# EAGLE schematic bigben (EAGLE 6.5.0)
AUTHOR: Brad Campbell; REV: A; TITLE: BigBen
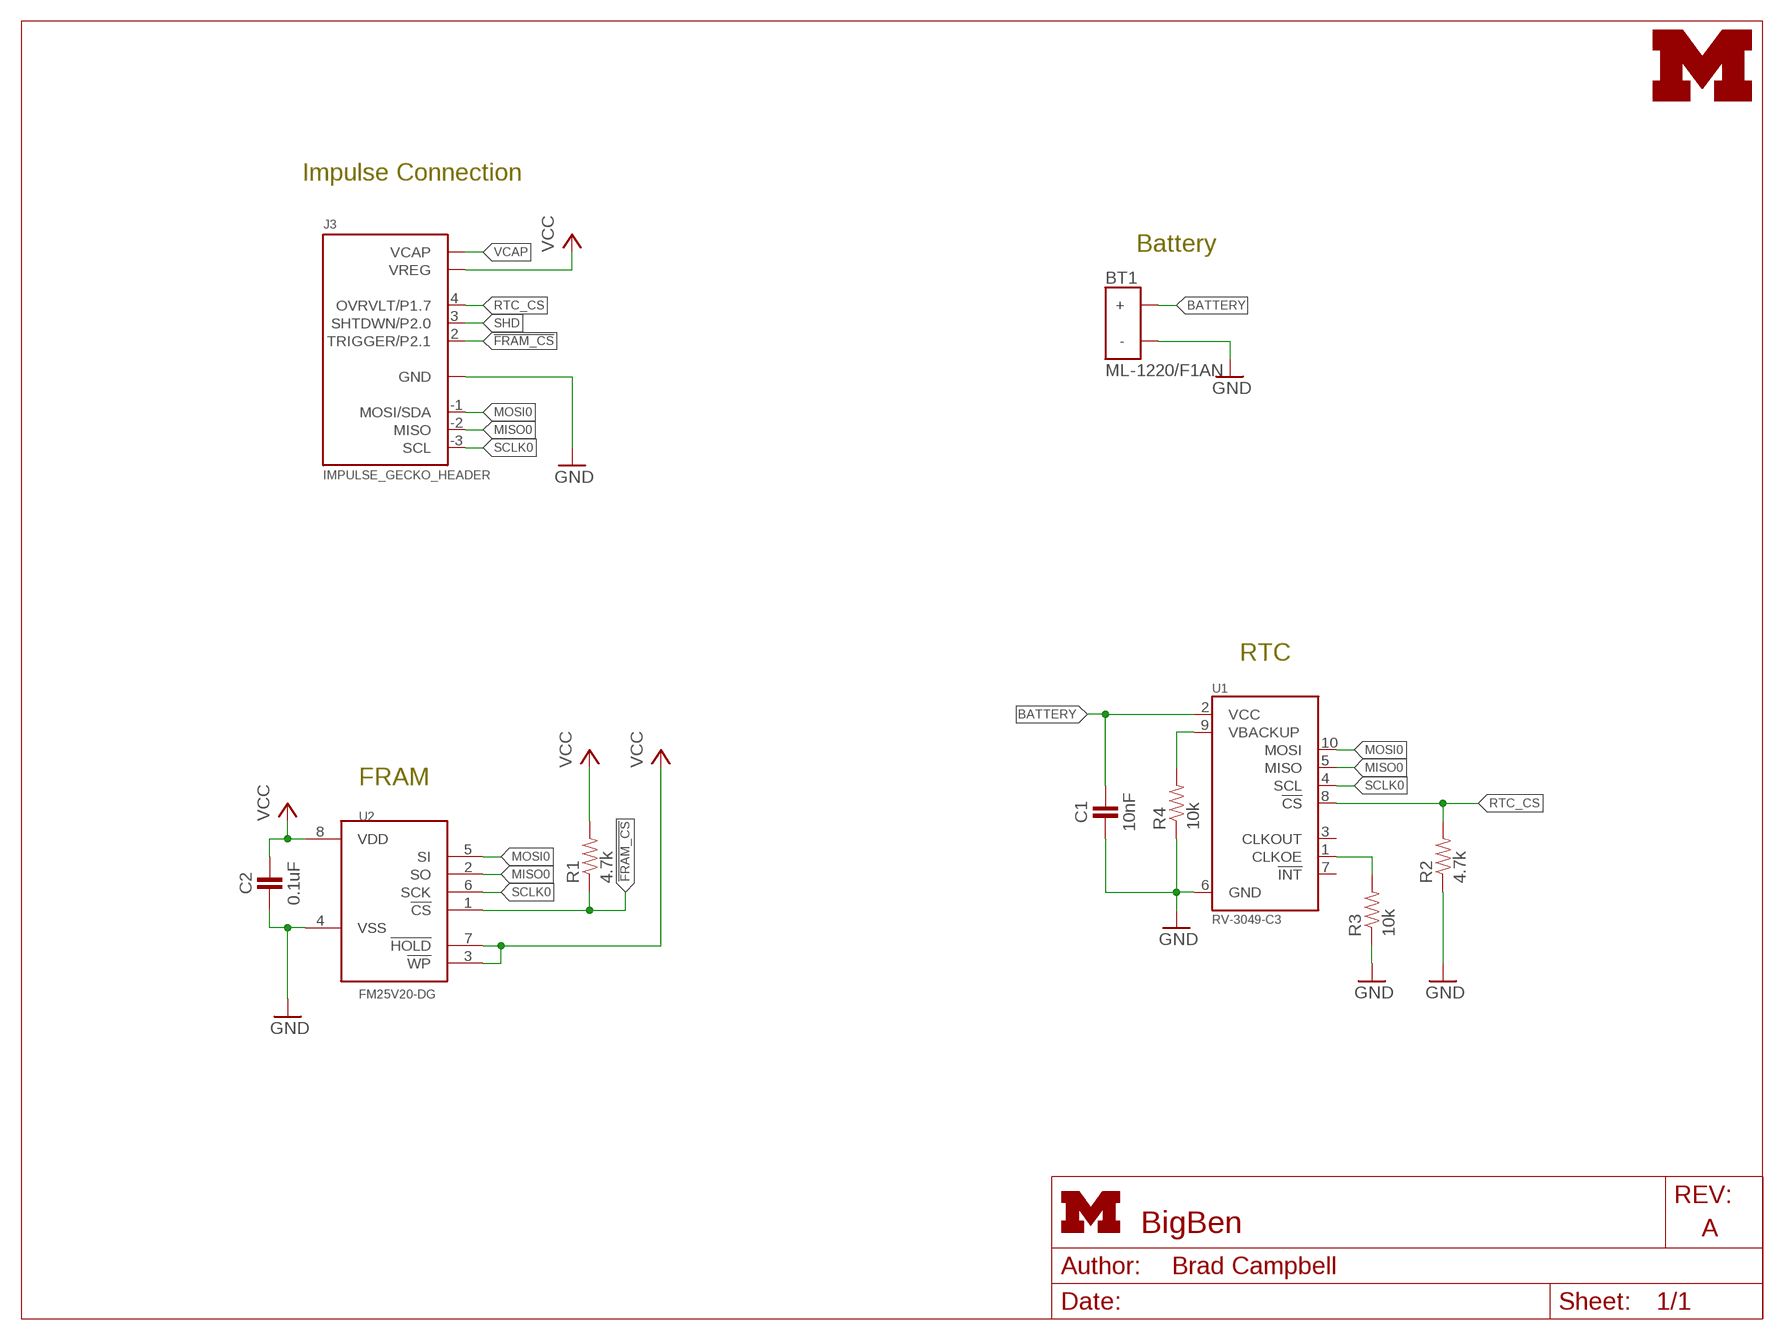
[diagram p0: schematic, sheet 1]
FRAME1 (LETTER_L): HEIGHT: 8.5in; WIDTH: 11in

## Parts
BT1  ML-1220/F1AN  [ML-1220/F1BN]
C1  10nF  CAPACITOR  [0402_CAP]
C2  0.1uF  CAPACITOR  [0402_CAP]
J3  IMPULSE_GECKO_HEADER  [HEADER1X9/0.05IN]
LOGO1  UMICH_SOLID_TINY  [UMICH_SOLID_50MIL]
R1  4.7k  RESISTOR  [0402_RES]
R2  4.7k  RESISTOR  [0402_RES]
R3  10k  RESISTOR  [0402_RES]
R4  10k  RESISTOR  [0402_RES]
U1  RV-3049-C3  [MICRO-CRYSTAL-C3]
U2  FM25V20-DG  [TDFN-8/6MM]

## Nets
!FRAM_CS: J3.2(TRIGGER/P2.1) R1.1 U2.1(!CS)
BATTERY: BT1.POS(+) C1.1 U1.2(VCC)
GND: BT1.NEG(-) C1.2 C2.2 J3.0(GND) R2.1 R3.1 R4.1 U1.6(GND) U2.4(VSS)
MISO0: J3.-2(MISO) U1.5(MISO) U2.2(SO)
MOSI0: J3.-1(MOSI/SDA) U1.10(MOSI) U2.5(SI)
N$6: R4.2 U1.9(VBACKUP)
N$7: R3.2 U1.1(CLKOE)
RTC_CS: J3.4(OVRVLT/P1.7) R2.2 U1.8(!CS)
SCLK0: J3.-3(SCL) U1.4(SCL) U2.6(SCK)
SHD: J3.3(SHTDWN/P2.0)
VCAP: J3.5(VCAP)
VCC: C2.1 J3.1(VREG) R1.2 U2.3(!WP) U2.7(!HOLD) U2.8(VDD)
Unconnected: U1.3(CLKOUT) U1.7(!INT)

## Notes on the sheet
- Impulse Connection
- Battery
- RTC
- FRAM

## Library data of the parts
BT1 = batteries:ML-1220/F1AN: BATTERY LITH 3V RECHARGE PC PINS; DIGIKEY: P663-nd; MOUSER: 658-ML-1220/F1BN
C1 C2 = passives:CAPACITOR: 0402 Capacitor
J3 = gecko:IMPULSE_GECKO_HEADER: Header on the impulse EPIC-esque board.
LOGO1 = logos:UMICH_SOLID
R1-R4 = passives:RESISTOR: Resistor Basic schematic elements and footprints for 0603, 1206, and PTH resistors.
U1 = chips:RV-3049-C3: The RV-3049-C3 is an ultra miniature Real-Time-Clock Module with embedded Crystal. This RTC has an SPI Bus (4-wire Serial- Interface) and offers temperature compensated time.
U2 = chips:FM25: Cypress FRAM; DIGIKEY: FM25V20-DGRA-ND; MOUSER: 877-FM25V20-DG